# EAGLE design Un_51_V3.0 (EAGLE 6.5.0)
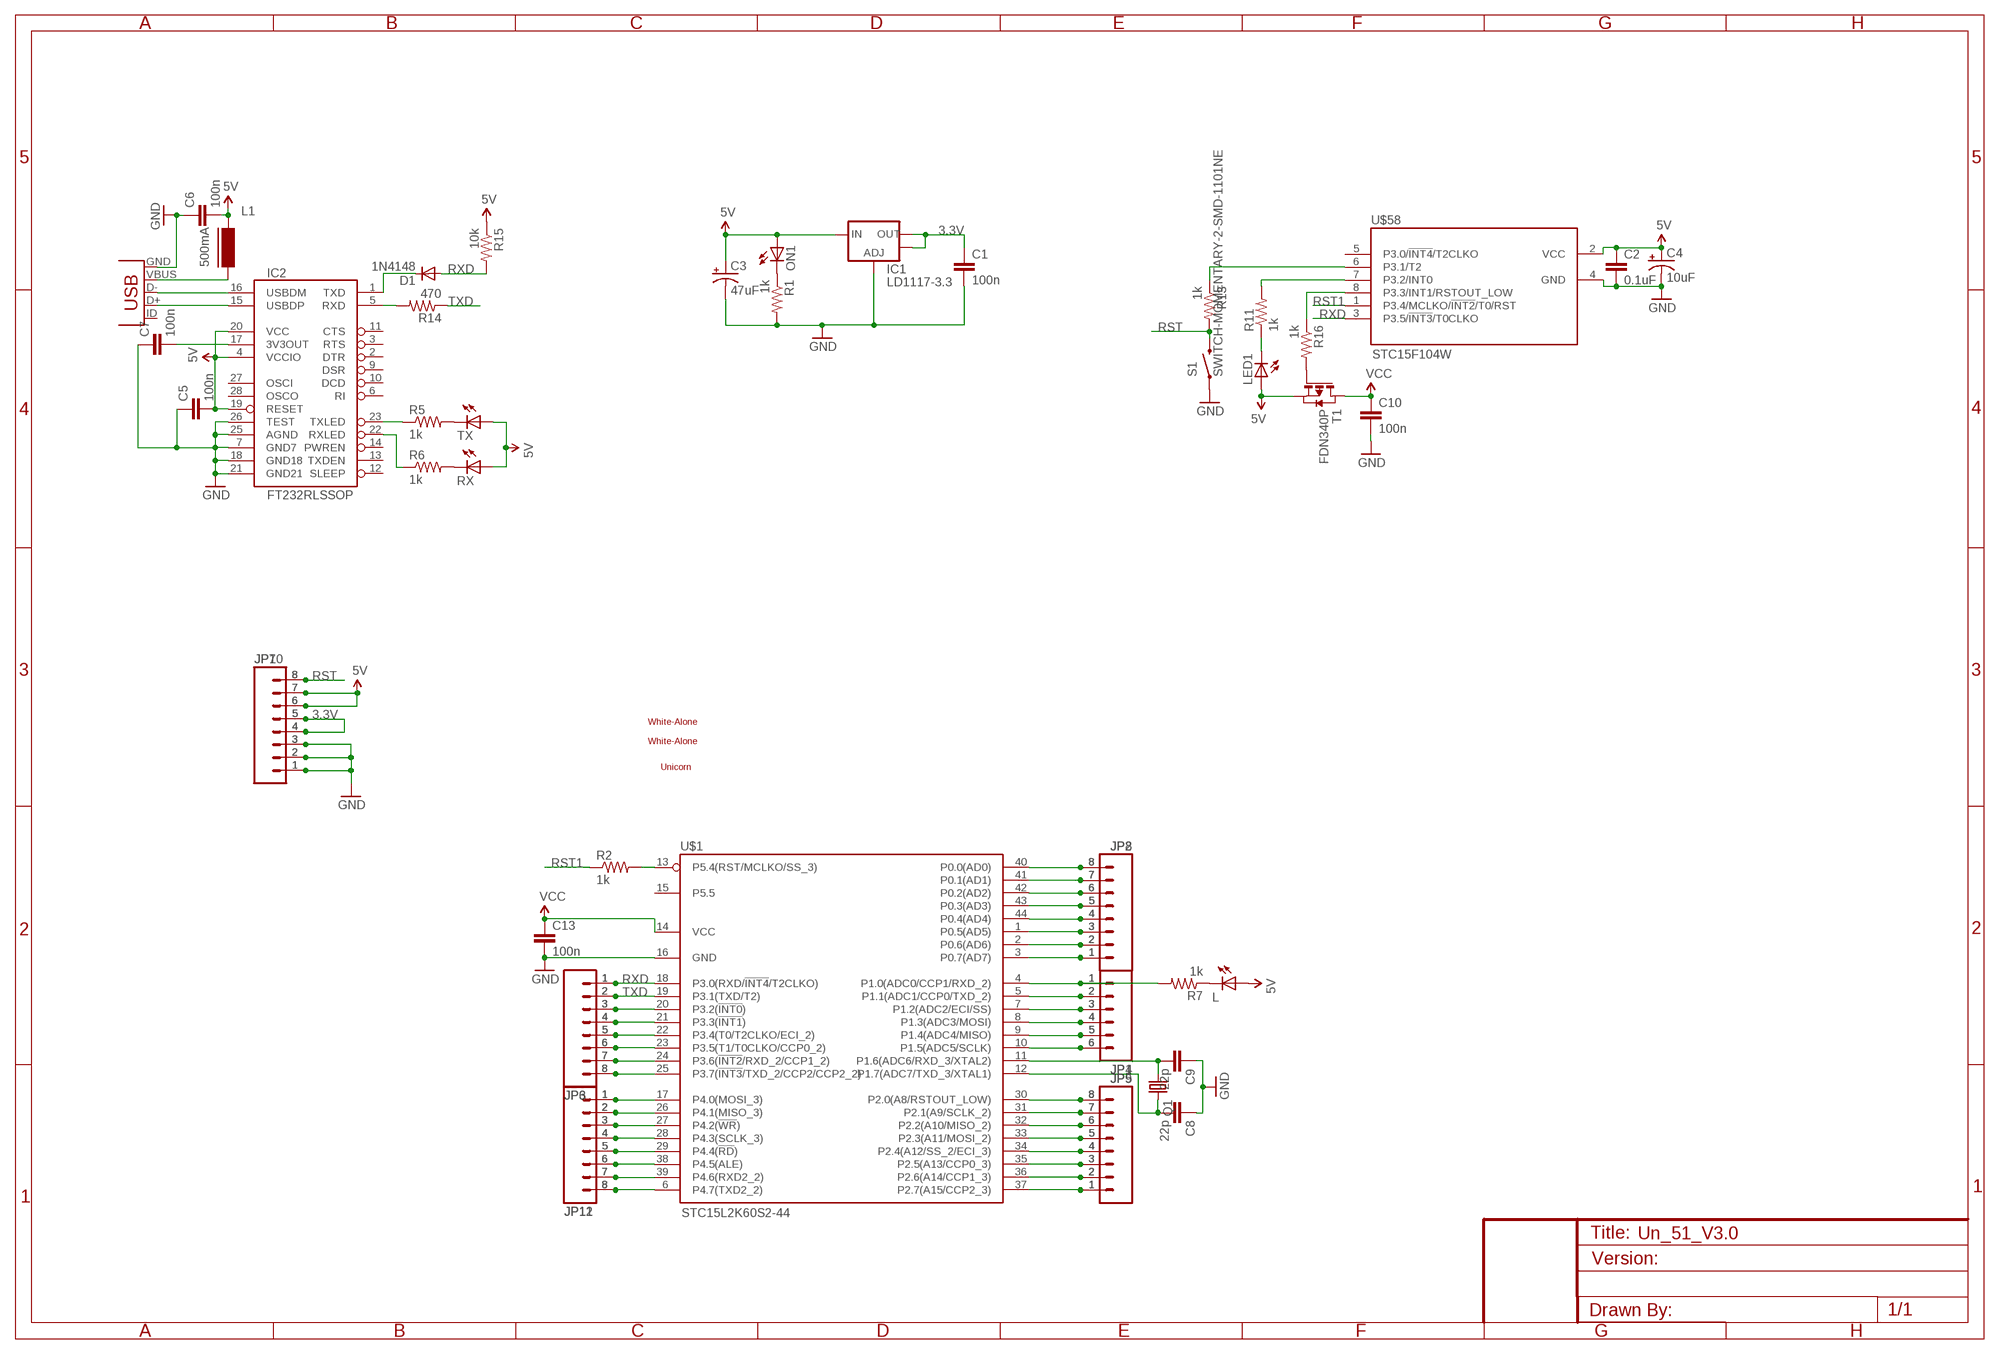
[diagram p0: schematic, sheet 1]

## Parts
C1  100n  CAP0603-CAP  [0603-CAP]
C2  0.1uF  CAP0603-CAP  [0603-CAP]
C3  47uF  CAP_POLD  [PANASONIC_D]
C4  10uF  CAP_POL1206  [EIA3216]
C5  100n  CAP0603-CAP  [0603-CAP]
C6  100n  CAP0603-CAP  [0603-CAP]
C7  100n  CAP0603-CAP  [0603-CAP]
C8  22p  CAP0603-CAP  [0603-CAP]
C9  22p  CAP0603-CAP  [0603-CAP]
C10  100n  CAP0603-CAP  [0603-CAP]
C13  100n  CAP0603-CAP  [0603-CAP]
D1  1N4148  DIODESOD  [SOD-323]
IC1  LD1117-3.3  V_REG_LM1117SOT223  [SOT223]
IC2  FT232RLSSOP  [SSOP28DB]
JP1  M06SIP  [1X06]
JP2  M08  [1X08]
JP3  M08  [1X08]
JP4  M06SIP  [1X06]
JP5  M08  [1X08]
JP6  M08  [1X08]
JP7  M08  [1X08]
JP8  M08  [1X08]
JP9  M08  [1X08]
JP10  M08  [1X08]
JP11  M08  [1X08]
JP12  M08  [1X08]
L  LED0805  [LED-0805]
L1  500mA  FERRITE-0805  [FB805]
LED1  LED0805  [LED-0805]
ON1  LED0805  [LED-0805]
Q1  CRYSTALHC49US  [HC49US]
R1  1k  RESISTOR0603-RES  [0603-RES]
R2  1k  RESISTOR0603-RES  [0603-RES]
R5  1k  RESISTOR0603-RES  [0603-RES]
R6  1k  RESISTOR0603-RES  [0603-RES]
R7  1k  RESISTOR0603-RES  [0603-RES]
R11  1k  RESISTOR0603-RES  [0603-RES]
R13  1k  RESISTOR0603-RES  [0603-RES]
R14  470  RESISTOR0603-RES  [0603-RES]
R15  10k  RESISTOR0603-RES  [0603-RES]
R16  1k  RESISTOR0603-RES  [0603-RES]
RX  LED0805  [LED-0805]
S1  SWITCH-MOMENTARY-2-SMD-1101NE  [TACTILE-SWITCH-1101NE]
T1  FDN340P  PMOSSOT23  [SOT-23]
TX  LED0805  [LED-0805]
U$1  STC15L2K60S2-44  [TQFP44]
U$3  UNICORN_2  [UNICORN_2]
U$7  WHITE-ALONE_0  [WHITE-ALONE_0]
U$11  WHITE-ALONE_0  [WHITE-ALONE_0]
U$58  STC15F104W  [SO08]
X2  USBSMD  [USB-MINIB]

## Nets
3.3V: C1.1 IC1.2(OUT) IC1.4(OUT) JP7.4 JP7.5 JP10.4 JP10.5
5V [usbvcc]: C2.1 C3.+ C4.A(+) C5.2 C6.2 IC1.3(IN) IC2.4(VCCIO) IC2.19(RESET) IC2.20(VCC) JP7.6 JP7.7 JP10.6 JP10.7 L1.1 L.1(A) LED1.1(A) ON1.1(A) R15.1 RX.1(A) T1.2(S) TX.1(A) U$58.2(VCC)
GND [gnd]: C1.2 C2.2 C3.- C4.C(-) C5.1 C6.1 C7.1 C8.1 C9.1 C10.2 C13.2 IC1.1(ADJ) IC2.7(GND7) IC2.18(GND18) IC2.21(GND21) IC2.25(AGND) IC2.26(TEST) JP7.1 JP7.2 JP7.3 JP10.1 JP10.2 JP10.3 R1.2 S1.P$1 U$1.16(GND) U$58.4(GND) X2.GND
MISO: JP2.6 JP8.6 U$1.42(P0.2(AD2))
MISO1: JP5.6 JP9.6 U$1.32(P2.2(A10/MISO_2))
MISO2: JP11.6 JP12.6 U$1.38(P4.5(ALE))
MOSI: JP2.5 JP8.5 U$1.43(P0.3(AD3))
MOSI1: JP5.5 JP9.5 U$1.33(P2.3(A11/MOSI_2))
MOSI2: JP11.5 JP12.5 U$1.29(P4.4(!RD!))
N$1: JP1.6 JP4.6 U$1.10(P1.5(ADC5/SCLK))
N$2: JP1.5 JP4.5 U$1.9(P1.4(ADC4/MISO))
N$3: L1.2 X2.VBUS
N$4: LED1.2(C) R11.1
N$5: IC2.16(USBDM) X2.D-
N$6: IC2.15(USBDP) X2.D+
N$7: IC2.23(TXLED) R5.1
N$8: R5.2 TX.2(C)
N$9: R6.2 RX.2(C)
N$10: IC2.22(RXLED) R6.1
N$11: JP3.8 JP6.8 U$1.25(P3.7(!INT3!/TXD_2/CCP2/CCP2_2))
N$12: JP1.4 JP4.4 U$1.8(P1.3(ADC3/MOSI))
N$13: JP1.3 JP4.3 U$1.7(P1.2(ADC2/ECI/SS))
N$14: JP1.2 JP4.2 U$1.5(P1.1(ADC1/CCP0/TXD_2))
N$15: JP3.7 JP6.7 U$1.24(P3.6(!INT2!/RXD_2/CCP1_2))
N$16: JP2.8 JP8.8 U$1.40(P0.0(AD0))
N$17: JP1.1 JP4.1 R7.2 U$1.4(P1.0(ADC0/CCP1/RXD_2))
N$18: JP2.2 JP8.2 U$1.2(P0.6(AD6))
N$19: JP2.1 JP8.1 U$1.3(P0.7(AD7))
N$20: R11.2 U$58.7(P3.2/INT0)
N$21: L.2(C) R7.1
N$22: C7.2 IC2.17(3V3OUT)
N$23: R2.2 U$1.13(P5.4(RST/MCLKO/SS_3))
N$24: JP3.3 JP6.3 U$1.20(P3.2(!INT0!))
N$25: JP3.4 JP6.4 U$1.21(P3.3(!INT1!))
N$26: JP3.5 JP6.5 U$1.22(P3.4(T0/T2CLKO/ECI_2))
N$27: JP3.6 JP6.6 U$1.23(P3.5(T1/T0CLKO/CCP0_2))
N$28: R16.1 U$58.8(P3.3/INT1/RSTOUT_LOW)
N$29: JP2.3 JP8.3 U$1.1(P0.5(AD5))
N$30: JP5.8 JP9.8 U$1.30(P2.0(A8/RSTOUT_LOW))
N$31: ON1.2(C) R1.1
N$32: R13.1 U$58.6(P3.1/T2)
N$33: JP5.3 JP9.3 U$1.35(P2.5(A13/CCP0_3))
N$34: JP5.2 JP9.2 U$1.36(P2.6(A14/CCP1_3))
N$35: IC2.5(RXD) R14.2
N$36: JP5.1 JP9.1 U$1.37(P2.7(A15/CCP2_3))
N$37: D1.1(C) IC2.1(TXD)
N$38: JP5.4 JP9.4 U$1.34(P2.4(A12/SS_2/ECI_3))
N$39: C8.2 Q1.2 U$1.12(P1.7(ADC7/TXD_3/XTAL1))
N$40: C9.2 Q1.1 U$1.11(P1.6(ADC6/RXD_3/XTAL2))
N$41: R16.2 T1.3(G)
N$42: JP11.8 JP12.8 U$1.6(P4.7(TXD2_2))
N$43: JP11.3 JP12.3 U$1.27(P4.2(!WR!))
N$44: JP11.2 JP12.2 U$1.26(P4.1(MISO_3))
N$45: JP11.1 JP12.1 U$1.17(P4.0(MOSI_3))
N$46: JP11.4 JP12.4 U$1.28(P4.3(SCLK_3))
N$48: JP2.4 JP8.4 U$1.44(P0.4(AD4))
RST: JP7.8 JP10.8 R13.2 S1.P$2
RST1: R2.1 U$58.1(P3.4/MCLKO/!INT2!/T0/RST)
RXD: D1.2(A) JP3.1 JP6.1 R15.2 U$1.18(P3.0(RXD/!INT4!/T2CLKO)) U$58.3(P3.5/!INT3!/T0CLKO)
SCK: JP2.7 JP8.7 U$1.41(P0.1(AD1))
SCK1: JP5.7 JP9.7 U$1.31(P2.1(A9/SCLK_2))
SCK2: JP11.7 JP12.7 U$1.39(P4.6(RXD2_2))
TXD: JP3.2 JP6.2 R14.1 U$1.19(P3.1(TXD/T2))
VCC [power]: C10.1 C13.1 T1.1(D) U$1.14(VCC)
Unconnected: IC2.2(DTR) IC2.3(RTS) IC2.6(RI) IC2.9(DSR) IC2.10(DCD) IC2.11(CTS) IC2.12(SLEEP) IC2.13(TXDEN) IC2.14(PWREN) IC2.27(OSCI) IC2.28(OSCO) U$1.15(P5.5) U$58.5(P3.0/!INT4!/T2CLKO) X2.ID(USBID)

## Library data of the parts
C1 C2 C5-C10 = 2SparkFun:CAP: Capacitor Standard 0603 ceramic capacitor, and 0.1" leaded capacitor.
C3 C4 = 2SparkFun:CAP_POL: Capacitor Polarized These are standard SMD and PTH capacitors. Normally 10uF, 47uF, and 100uF in electrolytic and tantalum varieties. Always verify the external diameter of the through hole cap, it varies with capacity, voltage, and manufacturer. The EIA devices should be standard.
C13 = 1SparkFun:CAP: Capacitor Standard 0603 ceramic capacitor, and 0.1" leaded capacitor.
D1 = 2SparkFun:DIODE: Diode These are standard reverse protection diodes and small signal diodes. SMA package can handle up to about 1A. SOD-323 can handle about 200mA. What the SOD-323 package when ordering, there are some mfgs out there that are 5-pin packages.
IC1 = 1SparkFun:V_REG_LM1117: Voltage Regulator LM1117 Standard adjustable voltage regulator but in SMD form. Spark Fun Electronics SKU : COM-00595
IC2 = 1SparkFun:FT232RL: USB UART FT232RL 4th Generation USB UART (USB <-> Serial) Controller. Spark Fun Electronics SKU : COM-00650
JP1 JP4 = 2SparkFun:M06: Header 6 Standard 6-pin 0.1" header. Use with straight break away headers (SKU : PRT-00116), right angle break away headers (PRT-00553), swiss pins (PRT-00743), machine pins (PRT-00117), and female headers (PRT-00115). Molex polarized connector foot print use with SKU : PRT-08094 with associated crimp pins and housings. NOTES ON THE VARIANTS LOCK and LOCK_LONGPADS... This footprint was designed to help hold the alignment of a through-hole component (i.e. 6-pin header) while soldering it into place. You may notice that each hole has been shifted either up or down by 0.005 of an inch from it's more standard position (which is a perfectly straight line). This slight alteration caused the pins (the squares in the middle) to touch the edges of the holes. Because they are alternating, it causes a "brace" to hold the component in place. 0.005 has proven to be the perfect amount of "off-center" position when using our standard breakaway headers. Although looks a little odd when you look at the bare footprint, once you have a header in there, the alteration is very hard to notice. Also, if you push a header all the way into place, it is covered up entirely on the bottom side. This idea of altering the position of holes to aid alignment will be further integrated into the Sparkfun Library for other footprints. It can help hold any component with 3 or more connection pins.
JP2 JP3 JP5-JP12 = 1SparkFun:M08: Header 8 Standard 8-pin 0.1" header. Use with straight break away headers (SKU : PRT-00116), right angle break away headers (PRT-00553), swiss pins (PRT-00743), machine pins (PRT-00117), and female headers (PRT-00115).
L ON1 RX TX = 1SparkFun:LED: LEDs Standard schematic elements and footprints for 5mm, 3mm, 1206, and 0603 sized LEDs. 5mm - Spark Fun Electronics SKU : COM-00529 (and others)
L1 = 2SparkFun:FERRITE: Ferrite bead in various packages
LED1 = 2SparkFun:LED: LEDs Standard schematic elements and footprints for 5mm, 3mm, 1206, and 0603 sized LEDs. 5mm - Spark Fun Electronics SKU : COM-00529 (and others)
Q1 = 1SparkFun:CRYSTAL: Crystals Various standard crystals. Proven footprints. Spark Fun Electronics SKU : COM-00534
R1 R2 R5-R7 R11 R13-R16 = 2SparkFun:RESISTOR: Resistor Basic schematic elements and footprints for 0603, 1206, and PTH resistors.
S1 = 2SparkFun:SWITCH-MOMENTARY-2
T1 = zetex:PMOSSOT23: MOS FET; OC_FARNELL: unknown; OC_NEWARK: unknown
U$1 = 2SparkFun:STC15L2K60S2-44
U$3 = 2SparkFun:UNICORN
U$7 U$11 = 2SparkFun:WHITE-ALONE
U$58 = 2SparkFun:STC15F104W
X2 = 2SparkFun:USB: USB Connectors USB-B-PTH is fully proven SKU : PRT-00139 USB-miniB is fully proven SKU : PRT-00587 USB-A-PCB is untested. USB-A-H is throughly reviewed, but untested. Spark Fun Electronics SKU : PRT-00437 USB-B-SMT is throughly reviewed, but untested. Needs silkscreen touching up. USB-A-S has not been used/tested USB-MB-H has not been used/tested

## Net classes
0 default: width 0.254 mm, clearance 0.254 mm
1 power: width 0.61 mm, drill 0.61 mm, clearance 0.254 mm
2 gnd: width 0.305 mm, drill 0.381 mm, clearance 0.254 mm
3 usbvcc: width 0.508 mm, drill 0.61 mm, clearance 0.254 mm
4 aref: width 0.406 mm, drill 0.61 mm, clearance 0.254 mm

## Board
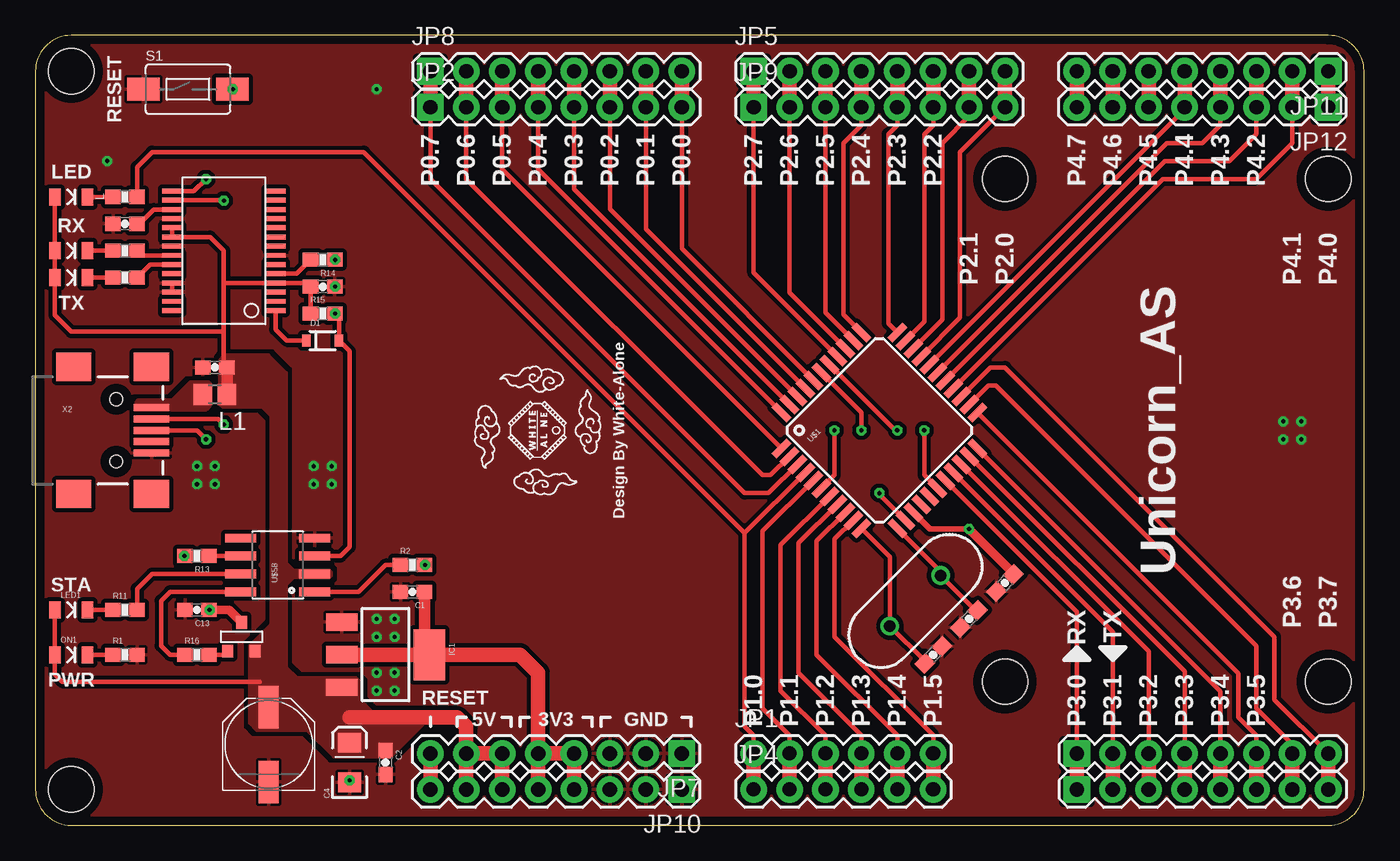
[diagram p1: board, top side]
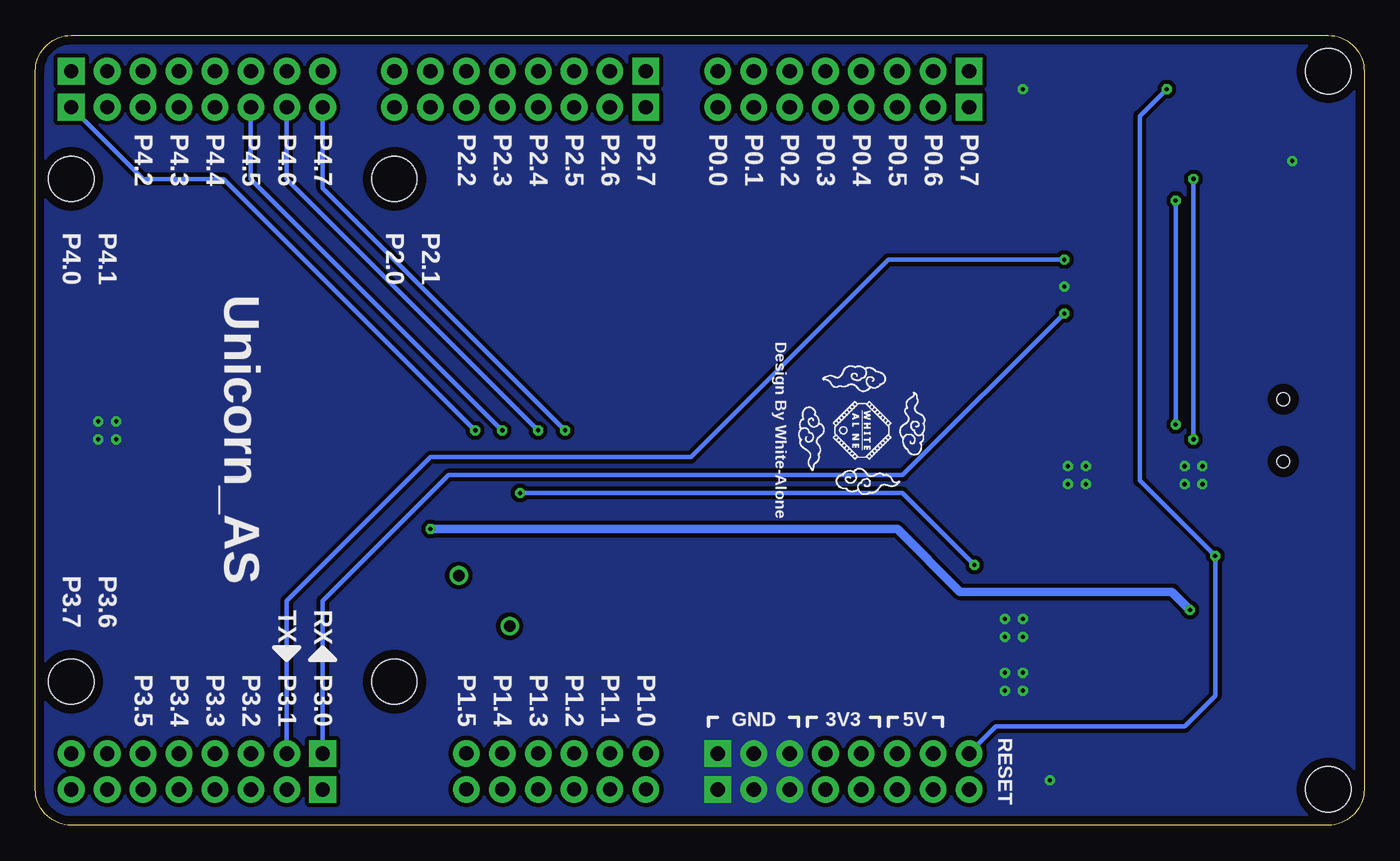
[diagram p2: board, bottom side, seen from below]

Size 93.98 x 55.88 mm. Coordinates in mm from the lower left corner, seen from the top.
Copper layers (1*16): Top 0.035mm / dielectric 1.5mm / Bottom 0.035mm
Design rules "yun": minimum track width 8mil, minimum drill 15mil, track to track 8mil, track to pad 8mil, pad to pad 8mil, via to via 8mil, smd to smd 8mil, copper to edge 25mil, drill to drill 8mil, minimum pad ring 10mil, minimum via ring 8mil, stop-mask expansion 4mil, vias tented up to drill 20mil, thermal gap 8mil

### Footprints (pad centres in the part's own frame; a part is rotated, then mirrored left to right if it is on the bottom)
0603-CAP = smd 1.1 x 1: 1 -0.85,0; 2 0.85,0
PANASONIC_D = smd 3 x 1.4: + 2.654,0; - -2.654,0
EIA3216 = smd 1.4 x 1.6: A 1.4,0; C -1.4,0
SOD-323 = smd 0.63 x 0.83: 1 -1.15,0; 2 1.15,0
SOT223 = smd 1.219 x 2.235: 1 -2.311,-3.099; 2 0,-3.099; 3 2.311,-3.099 | smd 3.6 x 2.2: 4 0,3.099
SSOP28DB = smd 0.348 x 1.397: 1 -4.225,-3.656; 2 -3.575,-3.656; 3 -2.925,-3.656; 4 -2.275,-3.656; 5 -1.625,-3.656; 6 -0.975,-3.656; 7 -0.325,-3.656; 8 0.325,-3.656; 9 0.975,-3.656; 10 1.625,-3.656; 11 2.275,-3.656; 12 2.925,-3.656; 13 3.575,-3.656; 14 4.225,-3.656; 15 4.225,3.656; 16 3.575,3.656; 17 2.925,3.656; 18 2.275,3.656; 19 1.625,3.656; 20 0.975,3.656; 21 0.325,3.656; 22 -0.325,3.656; 23 -0.975,3.656; 24 -1.625,3.656; 25 -2.275,3.656; 26 -2.925,3.656; 27 -3.575,3.656; 28 -4.225,3.656
1X06 = drill 1 pad 1.88: 1 0,0; 2 2.54,0; 3 5.08,0; 4 7.62,0; 5 10.16,0; 6 12.7,0
1X08 = drill 1.016 pad 1.88 square: 1 0,0 | drill 1.016 pad 1.88: 2 2.54,0; 3 5.08,0; 4 7.62,0; 5 10.16,0; 6 12.7,0; 7 15.24,0; 8 17.78,0
LED-0805 = smd 0.8 x 1.2: 1 -1.154,0; 2 1.154,0
FB805 = smd 1.3 x 1.5: 1 -0.85,0; 2 0.85,0
HC49US = drill 0.813: 1 -2.54,0; 2 2.54,0
0603-RES = smd 1.1 x 1: 1 -0.85,0; 2 0.85,0
TACTILE-SWITCH-1101NE = smd 2.3 x 1.6: P$1 -3.15,0; P$2 3.15,0
SOT-23 = smd 0.787 x 0.889: 1 0.025,-1.016; 2 -0.94,1.016; 3 0.991,1.016
TQFP44 = smd 1.5 x 0.5: 1 -5.8,4; 2 -5.8,3.2; 3 -5.8,2.4; 4 -5.8,1.6; 5 -5.8,0.8; 6 -5.8,0; 7 -5.8,-0.8; 8 -5.8,-1.6; 9 -5.8,-2.4; 10 -5.8,-3.2; 11 -5.8,-4; 23 5.8,-4; 24 5.8,-3.2; 25 5.8,-2.4; 26 5.8,-1.6; 27 5.8,-0.8; 28 5.8,0; 29 5.8,0.8; 30 5.8,1.6; 31 5.8,2.4; 32 5.8,3.2; 33 5.8,4 | smd 0.5 x 1.5: 12 -4,-5.8; 13 -3.2,-5.8; 14 -2.4,-5.8; 15 -1.6,-5.8; 16 -0.8,-5.8; 17 0,-5.8; 18 0.8,-5.8; 19 1.6,-5.8; 20 2.4,-5.8; 21 3.2,-5.8; 22 4,-5.8; 34 4,5.8; 35 3.2,5.8; 36 2.4,5.8; 37 1.6,5.8; 38 0.8,5.8; 39 0,5.8; 40 -0.8,5.8; 41 -1.6,5.8; 42 -2.4,5.8; 43 -3.2,5.8; 44 -4,5.8
UNICORN_2 = hole 3.2: -33.02,-25.4; 33.02,17.78; 33.02,-17.78; -33.02,25.4; 55.88,17.78; 55.88,-17.78
SO08 = smd 0.61 x 2.21: 1 -1.905,-2.616; 2 -0.635,-2.616; 3 0.635,-2.616; 4 1.905,-2.616; 5 1.905,2.616; 6 0.635,2.616; 7 -0.635,2.616; 8 -1.905,2.616
USB-MINIB = smd 2.5 x 0.5: D+ 2.5,0; D- 2.5,0.8; GND 2.5,-1.6; ID 2.5,-0.8; VBUS 2.5,1.6 | smd 2.5 x 2: MTN1 -3,4.5; MTN2 2.5,4.5; MTN3 -3,-4.5; MTN4 2.5,-4.5 | hole 0.9: 0,2.2; 0,-2.2

### Placement (x,y rotation side)
C1  26.67,16.51 180 top
C2  24.77,4.45 270 top
C3  16.51,5.71 90 top
C4  22.23,4.45 90 top
C5  20.32,38.1 180 top
C6  12.7,32.38 0 top
C7  6.35,42.55 0 top
C8  66.04,14.61 45 top
C9  63.5,12.06 225 top
C10  68.58,17.14 225 top
C13  11.43,15.24 180 top
D1  20.32,34.29 0 top
IC1  24.77,12.06 270 top
IC2  13.34,40.64 90 top
JP1  50.8,5.08 0 top
JP2  27.94,50.8 0 top
JP3  73.66,2.54 0 top
JP4  50.8,2.54 0 top
JP5  50.8,53.34 0 top
JP6  73.66,5.08 0 top
JP7  45.72,5.08 180 top
JP8  27.94,53.34 0 top
JP9  50.8,50.8 0 top
JP10  45.72,2.54 180 top
JP11  91.44,53.34 180 top
JP12  91.44,50.8 180 top
L  2.54,44.45 0 top
L1  12.7,30.48 180 top
LED1  2.54,15.24 0 top
ON1  2.54,12.06 0 top
Q1  62.23,15.88 45 top
R1  6.35,12.06 0 top
R2  26.67,18.41 0 top
R5  6.35,38.73 180 top
R6  6.35,40.64 180 top
R7  6.35,44.45 0 top
R11  6.35,15.24 0 top
R13  11.43,19.05 180 top
R14  20.32,40.01 180 top
R15  20.32,36.2 0 top
R16  11.43,12.06 0 top
RX  2.54,40.64 0 top
S1  10.79,52.07 0 top
T1  14.61,13.34 180 top
TX  2.54,38.73 0 top
U$1  59.69,27.94 45 top
U$3  35.56,27.94 0 top
U$7  35.56,27.94 90 top
U$11  35.56,27.94 270 bottom
U$58  17.14,18.41 90 top
X2  5.71,27.94 0 top

### Tracks (layer width: path | path; a pad name or v marks a point on that pad's centre or on a via)
3.3V
  Top 0.813: C1.1 27.52,12.28 27.3,12.06
  Top 1.016: IC1.2 27.3,12.06 IC1.4 34.29,12.06 35.56,10.79 JP7.5 | JP7.5 JP7.4 JP10.4 | JP10.5 JP7.5
5V
  Top 0.305: R15.1 C5.2 19.2,38.37 IC2.4 13.34,38.37 | IC2.19 IC2.20 12.36,41.62 13.34,40.64 13.34,38.37 | L.1 RX.1 TX.1 1.39,36.08 2.54,34.92 13.34,34.92 | 13.34,38.37 13.34,34.92 | 13.34,34.92 13.34,32.6 C6.2 | LED1.1 ON1.1 1.39,10.68 1.91,10.16 15.88,10.16
  Top 0.813: L1.1 C6.2
  Top 1.016: JP10.6 JP7.6 JP7.7 | JP10.7 JP7.7 | JP7.7 30.48,6.99 29.84,7.62 22.23,7.62
  pour Top (isolate 0.305, no thermals): 15.62,6.73 19.18,6.73 21.08,4.83 25.15,4.83 27.81,7.49 27.81,8 23.88,8 23.11,8.76 23.11,10.03 22.73,10.41 18.54,10.41 17.78,11.18 17.78,17.02 18.29,17.53 20.83,17.53 20.95,17.65 20.95,17.91 20.83,18.03 18.29,18.03 17.78,18.54 17.78,32 16.51,33.27 13.34,33.27 13,32.84 13,29.79 13.21,29.59 16,29.59 16.64,28.96 16.64,14.22 15.11,12.7 15.11,7.24
GND  (via drill 0.3)
  Top 0.305: IC2.25 IC2.26
  other vias: 22.23,3.17 24.13,13.34 25.4,13.34 24.13,10.79 25.4,10.79 21.21,38.1 24.13,14.61 25.4,14.61 24.13,9.53 25.4,9.53 24.13,52.07 88.27,28.57 88.27,27.3 5.08,46.99 11.43,25.4 12.7,25.4 11.43,24.13 12.7,24.13 19.68,24.13 20.95,24.13 20.95,25.4 19.68,25.4 89.53,27.3 89.53,28.57
  pour Bottom (isolate 0.305, rank 2, no thermals): 0,0 93.98,0 93.98,55.88 0,55.88
  pour Top (isolate 0.305, rank 2): 0,0 93.98,0 93.98,55.88 0,55.88
MISO
  Top 0.305: JP2.6 40.64,46.99 40.64,46.14 40.64,43.6 U$1.42
  Top 1.016: JP2.6 JP8.6
MISO1
  Top 0.305: U$1.32 62.87,35.64 62.87,48.9 63.5,49.53 JP9.6
  Top 1.016: JP9.6 JP5.6
MISO2  (via drill 0.3)
  Top 0.305: U$1.38 60.82,27.94 v60.96,27.94
  Top 1.016: JP12.6 JP11.6
  Bottom 0.305: JP12.6 78.74,45.72 v60.96,27.94
MOSI
  Top 0.305: JP2.5 38.1,48.26 38.1,47.55 38.1,45.01 U$1.43
  Top 1.016: JP2.5 JP8.5
MOSI1
  Top 0.305: U$1.33 60.33,35.51 60.33,48.9 60.96,49.53 JP9.5
  Top 1.016: JP9.5 JP5.5
MOSI2
  Top 0.305: U$1.29 81.28,50.66 JP12.5
  Top 1.016: JP12.5 JP11.5
N$1
  Top 0.305: U$1.10 56.52,20.24 56.52,13.34 63.5,6.35 JP1.6
  Top 1.016: JP4.6 JP1.6
N$2
  Top 0.305: U$1.9 55.24,20.1 55.24,12.06 60.96,6.35 JP1.5
  Top 1.016: JP4.5 JP1.5
N$3
  pour Top (isolate 0.305, no thermals): 7.09,29.39 12.12,29.39 12.37,29.64 12.4,31.24 12.27,31.37 10.92,31.37 9.65,30.1 7.24,30.1 7.09,29.9
N$4
  Top 0.305: LED1.2 R11.1
N$5  (via drill 0.3)
  Top 0.305: IC2.16 13.32,44.22 v13.34,44.2 | X2.D- 12.94,28.74 v13.34,28.35
  Bottom 0.305: v13.34,28.35 v13.34,44.2
N$6  (via drill 0.3)
  Top 0.305: X2.D+ 11.43,27.94 v12.06,27.3 | IC2.15 11.21,44.87 v12.06,45.72
  Bottom 0.305: v12.06,27.3 v12.06,45.72
N$7
  Top 0.305: IC2.23 8.13,39.66 R5.1
N$8
  Top 0.305: TX.2 R5.2
N$9
  Top 0.305: RX.2 R6.2
N$10
  Top 0.305: IC2.22 7.53,40.31 R6.1
N$11
  Top 0.305: U$1.25 67.53,32.38 68.58,32.38 87.63,13.34 87.63,8.89 JP6.8
  Top 1.016: JP3.8 JP6.8
N$12
  Top 0.305: U$1.8 53.98,19.96 53.98,10.79 58.42,6.35 58.42,4.45
  Top 1.016: JP4.4 58.42,4.45 JP1.4
N$13
  Top 0.305: U$1.7 52.7,19.82 52.7,9.53 55.88,6.35 JP1.3
  Top 1.016: JP4.3 JP1.3
N$14
  Top 0.305: U$1.5 51.44,20.82 51.44,8.26 53.34,6.35 JP1.2
  Top 1.016: JP4.2 JP1.2
N$15
  Top 0.305: U$1.24 67.39,31.11 67.94,31.11 86.36,12.7 86.36,8.26 88.9,5.71 JP6.7
  Top 1.016: JP3.7 JP6.7
N$16
  Top 0.305: JP2.8 45.72,40.78 U$1.40
  Top 1.016: JP2.8 JP8.8
N$17
  Top 0.305: U$1.4 50.16,20.68 | 50.16,20.68 50.16,6.99 50.8,6.35 JP1.1 | R7.2 7.2,46.57 8.26,47.62 23.22,47.62 50.16,20.68
  Top 1.016: JP4.1 JP1.1
N$18
  Top 0.305: JP2.2 30.48,48.9 30.48,48.26 30.48,45.72 51.44,24.77 51.99,24.77 U$1.2
  Top 1.016: JP2.2 JP8.2
N$19
  Top 0.305: U$1.3 51.85,23.5 50.16,23.5 27.94,45.72 JP2.1
  Top 1.016: JP2.1 JP8.1
N$20
  Top 0.305: U$58.7 8.26,17.78 7.2,16.73 R11.2
N$21
  Top 0.305: L.2 R7.1
N$22
  Top 0.305: C7.2 7.37,42.55 8.38,43.56 IC2.17
N$23  (via drill 0.3)
  Top 0.305: v27.56,18.41 R2.2 | U$1.13 59.69,23.41 v59.69,23.5
  Bottom 0.305: v27.56,18.41 32.64,23.5 v59.69,23.5
N$24
  Top 0.305: U$1.20 78.74,12.28 JP6.3
  Top 1.016: JP3.3 JP6.3
N$25
  Top 0.305: U$1.21 81.28,10.88 JP6.4
  Top 1.016: JP3.4 JP6.4
N$26
  Top 0.305: U$1.22 83.82,9.47 JP6.5
  Top 1.016: JP3.5 JP6.5
N$27
  Top 0.305: U$1.23 85.09,10.74 85.09,7.62 86.36,6.35 JP6.6
  Top 1.016: JP3.6 JP6.6
N$28
  Top 0.305: U$58.8 9.53,16.51 8.89,15.88 8.89,12.7 9.53,12.06 R16.1
N$29
  Top 0.305: U$1.1 33.02,46.41 JP2.3
  Top 1.016: JP2.3 JP8.3
N$30
  Top 0.305: JP9.8 65.41,47.62 65.41,35.92 U$1.30
  Top 1.016: JP9.8 JP5.8
N$31
  Top 0.305: ON1.2 R1.1
N$32
  Top 0.305: U$58.6 R13.1
N$33
  Top 0.305: JP9.3 55.88,36.27 U$1.35
  Top 1.016: JP9.3 JP5.3
N$34
  Top 0.305: JP9.2 53.34,37.68 U$1.36
  Top 1.016: JP9.2 JP5.2
N$35
  Top 0.305: IC2.5 18.48,39.02 R14.2
N$36
  Top 0.305: JP9.1 50.8,39.09 U$1.37
  Top 1.016: JP9.1 JP5.1
N$37
  Top 0.305: IC2.1 16.99,35.08 17.78,34.29 D1.1
N$38
  Top 0.305: U$1.34 57.15,36.14 57.15,48.26 58.42,49.53 JP9.4
  Top 1.016: JP9.4 JP5.4
N$39
  Top 0.305: U$1.12 64.03,17.95 Q1.2 66.49,15.21 C8.2
N$40
  Top 0.305: C9.2 62.9,11.61 Q1.1 60.43,18.99 U$1.11
N$41
  Top 0.305: R16.2 13.36,12.06 T1.3
N$42  (via drill 0.3)
  Top 0.305: U$1.6 56.52,24.77 v56.52,27.94
  Top 1.016: JP12.8 JP11.8
  Bottom 0.305: JP12.8 73.66,46.99 73.66,45.72 73.66,45.09 v56.52,27.94
N$43
  Top 0.305: JP12.3 86.36,48.9 84.45,46.99 79.87,46.99 U$1.27
  Top 1.016: JP12.3 JP11.3
N$44
  Top 0.305: JP12.2 88.9,48.26 86.36,45.72 79.73,45.72 U$1.26
  Top 1.016: JP12.2 JP11.2
N$45  (via drill 0.3)
  Top 0.305: U$1.17 62.87,24.77 v62.87,27.94
  Top 1.016: JP12.1 JP11.1
  Bottom 0.305: JP12.1 86.36,45.72 80.64,45.72 v62.87,27.94
N$46
  Top 0.305: JP12.4 83.82,49.53 82.55,48.26 80.01,48.26 U$1.28
  Top 1.016: JP12.4 JP11.4
N$48
  Top 0.305: U$1.44 35.56,46.41 35.56,51.44
  Top 1.016: JP2.4 35.56,51.44 JP8.4
RST  (via drill 0.3)
  Top 0.305: v10.54,19.05 R13.2 | v13.97,52.07 S1.P$2
  Top 1.016: JP10.8 JP7.8
  Bottom 0.305: JP7.8 26.04,6.99 12.7,6.99 10.54,9.14 v10.54,19.05 15.88,24.38 15.88,50.16 v13.97,52.07
RST1
  Top 0.305: R2.1 24.77,18.41 22.86,16.51 U$58.1
RXD  (via drill 0.3)
  Top 0.305: U$1.18 73.66,15.1 JP6.1 | R15.2 v21.21,36.2 21.47,35.93 D1.2 22.23,33.53 22.23,19.68 21.59,19.05 U$58.3
  Top 1.016: JP3.1 JP6.1
  Bottom 0.305: JP6.1 73.66,15.88 64.77,24.77 32.64,24.77 v21.21,36.2
SCK
  Top 0.305: JP2.7 43.18,45.09 43.18,44.73 43.18,42.19 U$1.41
  Top 1.016: JP2.7 JP8.7
SCK1
  Top 0.305: JP9.7 66.04,50.16 64.14,48.26 64.14,35.78 U$1.31
  Top 1.016: JP9.7 JP5.7
SCK2  (via drill 0.3)
  Top 0.305: U$1.39 58.42,29.21 v58.42,27.94
  Top 1.016: JP12.7 JP11.7
  Bottom 0.305: JP12.7 76.2,45.72 v58.42,27.94
TXD  (via drill 0.3)
  Top 0.305: U$1.19 76.2,13.69 JP6.2 | v21.21,40.01 R14.1
  Top 1.016: JP3.2 JP6.2
  Bottom 0.305: v21.21,40.01 33.66,40.01 47.62,26.04 66.04,26.04 76.2,15.88 JP6.2
VCC  (via drill 0.3)
  Top 0.406: U$1.14 63.28,20.95 v66.04,20.95
  Top 0.61: C13.1 v12.32,15.24 13.69,15.24 T1.1 | C10.1 69.18,17.81 v66.04,20.95
  Bottom 0.61: v66.04,20.95 33.02,20.95 28.57,16.51 13.59,16.51 v12.32,15.24

### Text on the board
tPlace: RESET | P0.7 | P0.6 | P0.5 | P0.4 | P0.3 | P0.2 | P0.1 | P0.0 | P2.7 | P2.6 | P2.5 | P2.4 | P2.3 | P2.2 | P4.7 | P4.6 | P4.5 | P4.4 | P4.3 | P4.2 | LED | RX | P2.1 | P2.0 | P4.1 | P4.0 | TX | Design By White-Alone | Unicorn_AS | STA | RX | TX | P3.6 | P3.7 | PWR | RESET | 5V | 3V3 | GND | P1.0 | P1.1 | P1.2 | P1.3 | P1.4 | P1.5 | P3.0 | P3.1 | P3.2 | P3.3 | P3.4 | P3.5
bPlace: P0.7 | P0.6 | P0.5 | P0.4 | P0.3 | P0.2 | P0.1 | P0.0 | P2.7 | P2.6 | P2.5 | P2.4 | P2.3 | P2.2 | P4.7 | P4.6 | P4.5 | P4.4 | P4.3 | P4.2 | P2.1 | P2.0 | P4.1 | P4.0 | Design By White-Alone | Unicorn_AS | RX | TX | P3.6 | P3.7 | 5V | 3V3 | GND | P1.0 | P1.1 | P1.2 | P1.3 | P1.4 | P1.5 | P3.0 | P3.1 | P3.2 | P3.3 | P3.4 | P3.5 | RESET